# EAGLE design Power Supply (EAGLE 6.2)
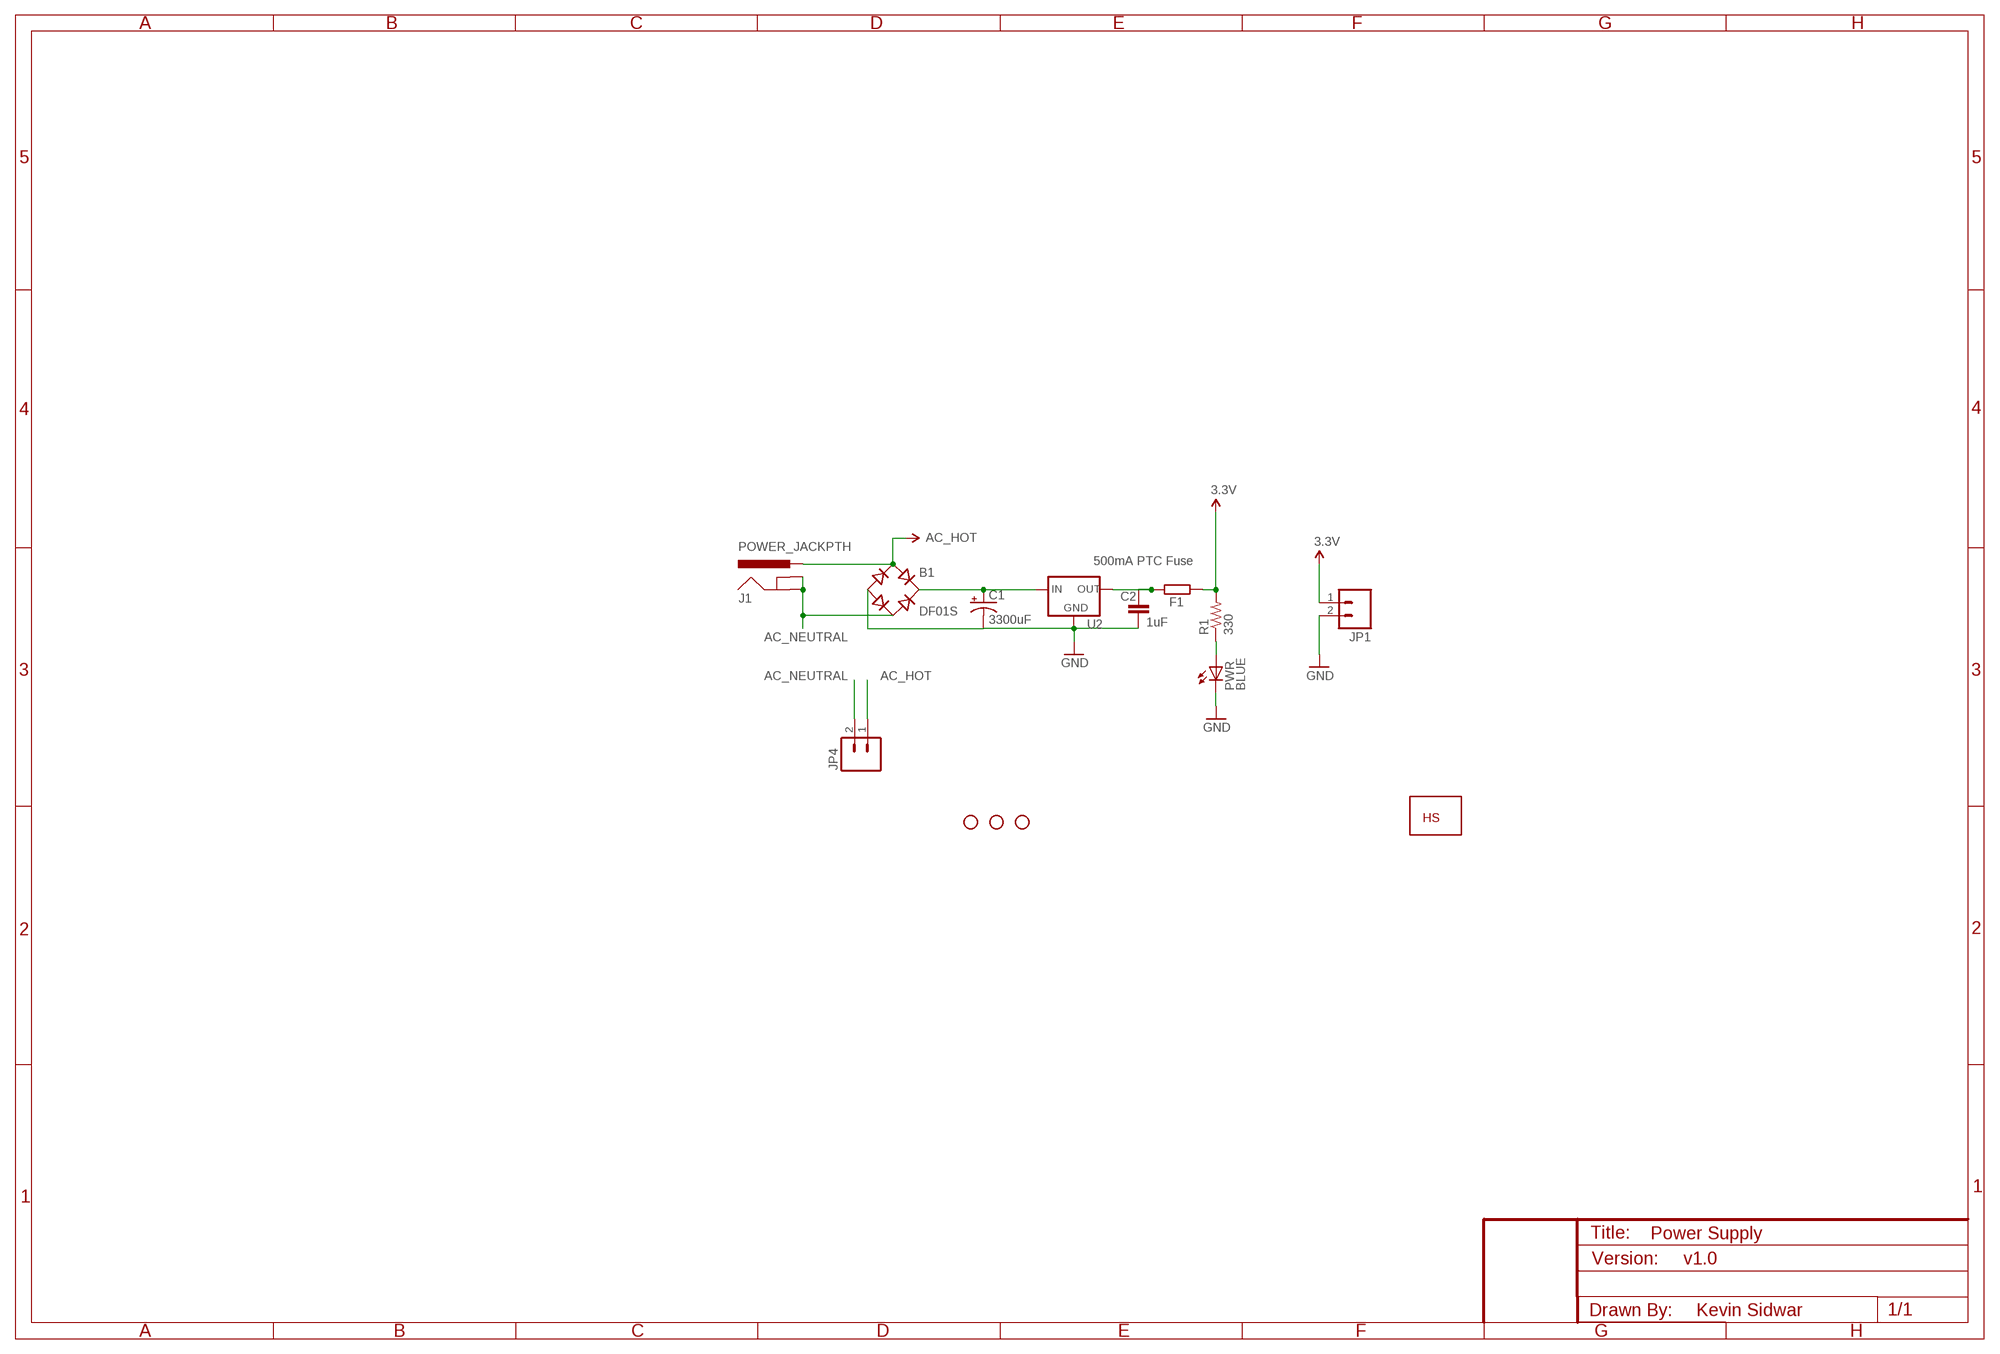
[diagram p0: schematic, sheet 1]

## Parts
B1  DF01S  [DFS]
C1  3300uF  CPOL-USE10-20  [EB20D]
C2  1uF  CAP0603-CAP  [0603-CAP]
F1  500mA PTC Fuse  R-EU_M1206  [M1206]
J1  POWER_JACKPTH  [POWER_JACK_PTH]
JP1  M02LOCK_LONGPADS  [1X02_LOCK_LONGPADS]
JP4  M02LOCK_LONGPADS  [1X02_LOCK_LONGPADS]
JP5  STAND-OFF  [STAND-OFF]
JP6  STAND-OFF  [STAND-OFF]
JP8  STAND-OFF  [STAND-OFF]
PWR  BLUE  LED0603  [LED-0603]
R1  330  RESISTOR0603-RES  [0603-RES]
U2  RECOM_X.X_REG78XX  [RECOM]
U$1  LOGONORMAL  [HS_LOGO]

## Nets
3.3V: F1.1 JP1.1 R1.2
AC_HOT: B1.AC1 J1.PWR JP4.1
AC_NEUTRAL: B1.AC2 J1.GND J1.GNDBREAK JP4.2
GND: B1.- C1.- C2.2 JP1.2 PWR.C U2.GND
N$1: C2.1 F1.2 U2.VOUT(OUT)
N$3: B1.+ C1.+ U2.VIN(IN)
N$4: PWR.A R1.1

## Notes on the sheet
- v1.0
- Kevin Sidwar

## Library data of the parts
B1 = lizardworx:DF*S: Surface Mount Glass Passivated Bridge Rectifiers Source: Source: Comchip Bridge Rectifiers DF005S-G thru DF10S-G.pdf
C1 = rcl:CPOL-US: POLARIZED CAPACITOR, American symbol
C2 = SparkFun-Passives:CAP: Capacitor Standard 0603 ceramic capacitor, and 0.1" leaded capacitor.
F1 = resistor:R-EU_: RESISTOR, European symbol
J1 = lizardworx:POWER_JACK: Power Jack This is the standard 5.5mm barrel jack for power. The PTH is the most common, proven, reliable, footprint. All others are experimental. The Slot footprint only works if the mill layer is transmitted to the PCB fab house so be warned. Spark Fun Electronics SKU : PRT-00119. Mating wall wart : TOL-00298 (and others)
JP1 JP4 = SparkFun-Connectors:M02: Header 2 Standard 2-pin 0.1" header. Use with straight break away headers (SKU : PRT-00116), right angle break away headers (PRT-00553), swiss pins (PRT-00743), machine pins (PRT-00117), and female headers (PRT-00115). Molex polarized connector foot print use with SKU : PRT-08233 with associated crimp pins and housings.
JP5 JP6 JP8 = SparkFun-Electromechanical:STAND-OFF: #4 Stand Off This is the mechanical footprint for a #4 phillips button head screw. Use the keepout ring to avoid running the screw head into surrounding components. SKU : PRT-00447
PWR = SparkFun:LED: LEDs Standard schematic elements and footprints for 5mm, 3mm, 1206, and 0603 sized LEDs. 5mm - Spark Fun Electronics SKU : COM-00529 (and others)
R1 = SparkFun-Passives:RESISTOR: Resistor Basic schematic elements and footprints for 0603, 1206, and PTH resistors.
U2 = lizardworx:RECOM_X.X_REG
U$1 = lizardworx:LOGO

## Board
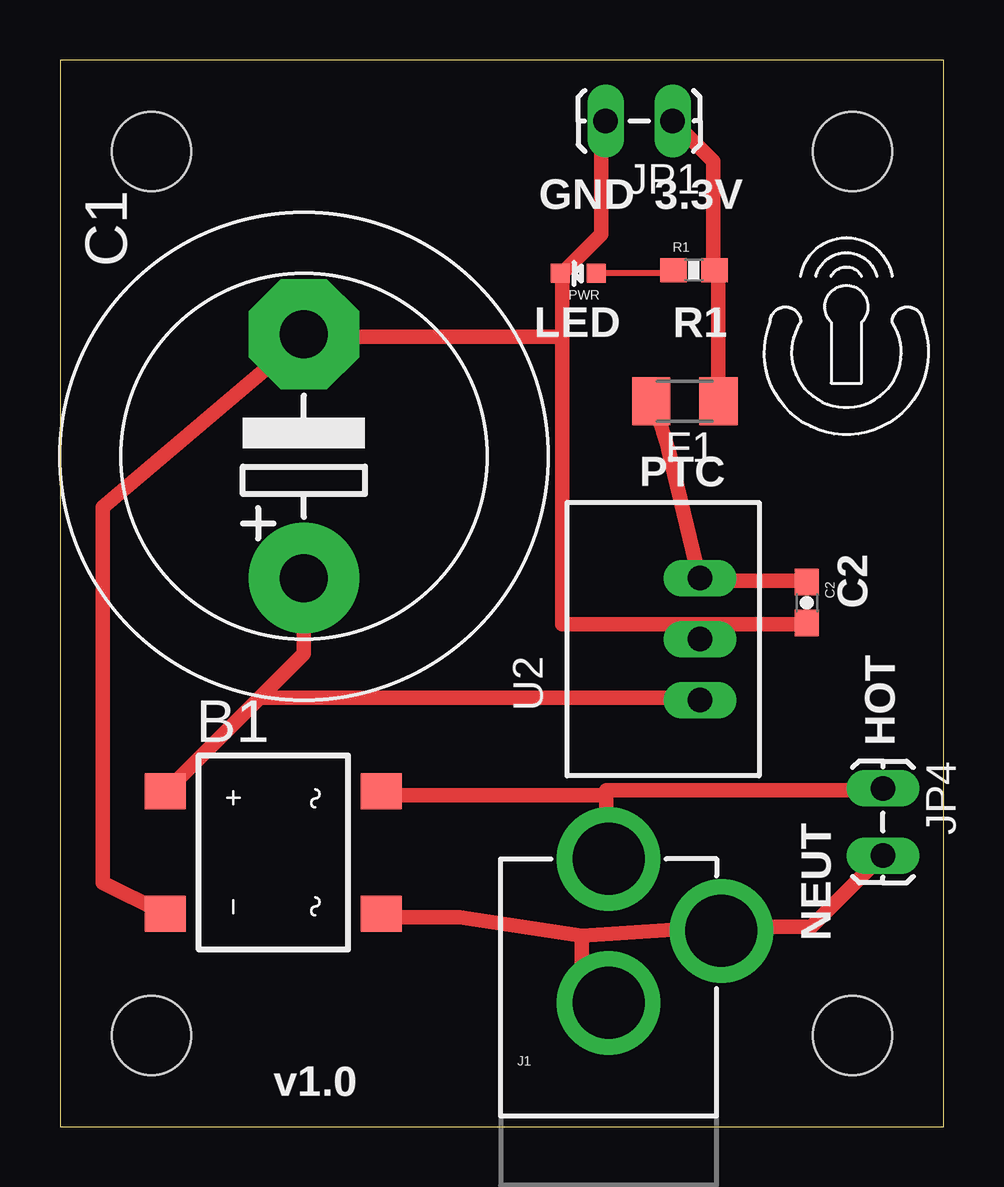
[diagram p1: board, top side]

Size 36.83 x 44.45 mm. Coordinates in mm from the lower left corner, seen from the top.
Outline: 0,0 36.83,0 36.83,44.45 0,44.45 0,0
Copper layers (1*16): Top 0.035mm / dielectric 1.5mm / Bottom 0.035mm
Design rules: minimum track width 10mil, minimum drill 24mil, track to track 8mil, track to pad 8mil, pad to pad 8mil, via to via 8mil, smd to smd 8mil, copper to edge 40mil, drill to drill 8mil, minimum pad ring 10mil, minimum via ring 8mil, stop-mask expansion 4mil, vias tented up to drill 0mil, thermal gap 10mil

### Footprints (pad centres in the part's own frame; a part is rotated, then mirrored left to right if it is on the bottom)
DFS = smd 1.5 x 1.7: + -2.55,-4.5; - 2.55,-4.5; AC1 -2.55,4.5; AC2 2.55,4.5
EB20D = drill 2.007 pad 4.597: + -5.08,0 | drill 2.007 pad 4.597 octagon: - 5.08,0
0603-CAP = smd 1.1 x 1: 1 -0.85,0; 2 0.85,0
M1206 = smd 1.6 x 2: 1 -1.4,0; 2 1.4,0
POWER_JACK_PTH = drill 2.997 pad 4.318: GND 0,7.7; GNDBREAK 4.7,10.7; PWR 0,13.7
1X02_LOCK_LONGPADS = drill 1.016 long: 1 -0.127,0; 2 2.667,0
STAND-OFF = hole 3.302: 0,0
LED-0603 = smd 0.8 x 0.8: A 0,-0.75; C 0,0.75
0603-RES = smd 1.1 x 1: 1 -0.85,0; 2 0.85,0
RECOM = drill 1.016 long: GND 0,-2.54; VIN -2.54,-2.54; VOUT 2.54,-2.54

### Placement (x,y rotation side)
B1  8.89,11.43 270 top
C1  10.16,27.94 90 top
C2  31.11,21.84 270 top
F1  26.04,30.23 180 top
J1  22.86,-2.54 0 top
JP1  25.4,41.91 180 top
JP4  34.29,13.97 270 top
JP5  33.02,40.64 0 top
JP6  3.81,40.64 0 top
JP7  STAND-OFF  [STAND-OFF]  33.02,3.81 0 top
JP8  3.81,3.81 0 top
PWR  21.59,35.56 90 top
R1  26.42,35.69 0 top
U2  24.13,20.32 90 top
U$1  32.13,33.53 0 top

### Tracks (layer width: path | path; a pad name or v marks a point on that pad's centre or on a via)
3.3V
  Top 0.254: 27.43,35.56 R1.2 27.23,35.76 | 27.43,30.28 F1.1 | 25.6,41.86 JP1.1
  Top 0.61: 27.43,30.28 27.43,35.56 | 25.6,41.86 27.23,40.23 27.23,35.76
AC_HOT
  Top 0.254: 13.41,13.82 B1.AC1 | 22.76,13.82 22.76,14.02 | 34.14,14.02 JP4.1
  Top 0.61: 13.41,13.82 22.76,13.82 22.76,11.18 J1.PWR | 22.76,14.02 34.14,14.02
AC_NEUTRAL
  Top 0.254: 34.14,11.18 JP4.2 | 13.41,8.74 B1.AC2 | 22.76,5.28 J1.GND | 27.43,8.33 J1.GNDBREAK
  Top 0.61: 34.14,11.18 31.29,8.33 27.64,8.33 J1.GNDBREAK | 13.41,8.74 16.66,8.74 21.74,7.95 | 21.74,7.95 21.74,6.3 22.76,5.28 | 21.74,7.95 27.43,8.33
GND
  Top 0.254: 26.82,20.93 26.82,20.32 U2.GND | 31.09,20.93 C2.2 | 22.55,41.86 JP1.2 | 20.93,35.56 PWR.C | 4.27,8.94 B1.- | 10.16,32.92 C1.-
  Top 0.61: 26.82,20.93 31.09,20.93 | 22.55,41.86 22.55,37.19 20.93,35.56 20.93,32.92 | 26.82,20.93 20.93,20.93 20.93,32.92 | 26.82,20.93 U2.GND | 4.27,8.94 1.78,10.16 1.78,25.81 10.16,32.92 20.93,32.92
N$1
  Top 0.254: 31.09,22.76 C2.1 | 26.82,22.76 U2.VOUT 26.62,22.96 | 24.79,30.07 F1.2
  Top 0.61: 26.82,22.76 31.09,22.76 | 24.79,30.07 25.35,28.25 26.62,22.96
N$3
  Top 0.254: 4.47,14.02 B1.+ | 26.62,17.88 U2.VIN
  Top 0.61: 8.33,17.88 10.16,19.71 C1.+ | 8.33,17.88 4.47,14.02 | 8.33,17.88 26.62,17.88
N$4
  Top 0.254: PWR.A 25.4,35.56 R1.1

### Text on the board
tPlace: GND | 3.3V | LED | R1 | PTC | C2 | HOT | NEUT | v1.0